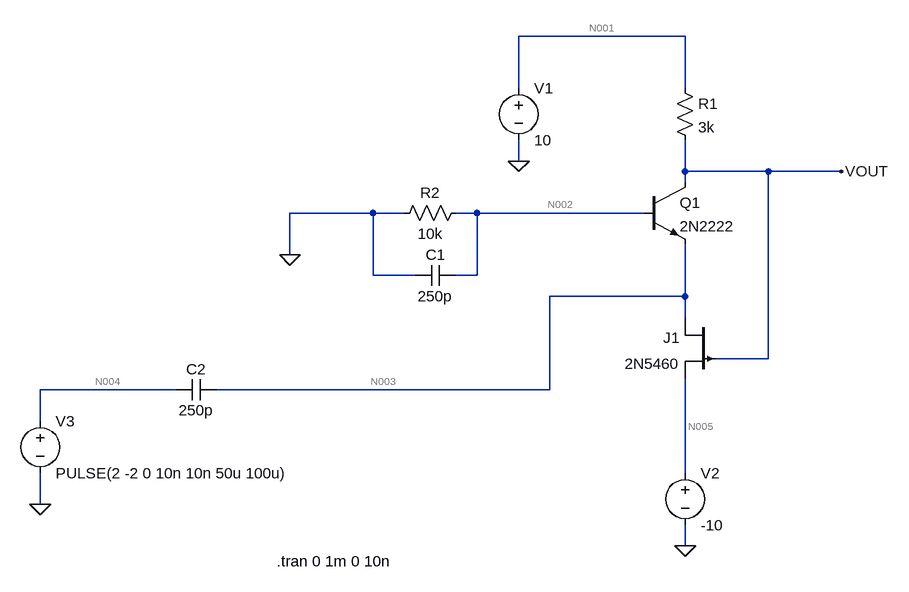
[diagram p0: schematic Bi_stable01.asc]
Bi_stable01.asc, the LTspice schematic file:
Version 4
SHEET 1 880 856
WIRE 336 32 80 32
WIRE 80 112 80 32
WIRE 336 112 336 32
WIRE 80 224 80 192
WIRE 336 240 336 192
WIRE 464 240 336 240
WIRE 576 240 464 240
WIRE 336 256 336 240
WIRE -144 304 -272 304
WIRE -96 304 -144 304
WIRE 16 304 -16 304
WIRE 272 304 16 304
WIRE -272 368 -272 304
WIRE -144 400 -144 304
WIRE -80 400 -144 400
WIRE 16 400 16 304
WIRE 16 400 -16 400
WIRE 336 432 336 352
WIRE 336 432 128 432
WIRE 336 464 336 432
WIRE 464 528 464 240
WIRE 464 528 384 528
WIRE -448 576 -656 576
WIRE 128 576 128 432
WIRE 128 576 -384 576
WIRE -656 624 -656 576
WIRE 336 704 336 560
WIRE -656 752 -656 704
WIRE 336 816 336 784
FLAG 80 224 0
FLAG 576 240 VOUT
FLAG 336 816 0
FLAG -656 752 0
FLAG -272 368 0
SYMBOL voltage 80 96 R0
WINDOW 123 0 0 Left 0
WINDOW 39 0 0 Left 0
SYMATTR InstName V1
SYMATTR Value 10
SYMBOL npn 272 256 R0
SYMATTR InstName Q1
SYMATTR Value 2N2222
SYMBOL res 320 96 R0
SYMATTR InstName R1
SYMATTR Value 3k
SYMBOL pjf 384 464 M0
SYMATTR InstName J1
SYMATTR Value 2N5460
SYMBOL voltage 336 688 R0
WINDOW 123 0 0 Left 0
WINDOW 39 0 0 Left 0
SYMATTR InstName V2
SYMATTR Value -10
SYMBOL voltage -656 608 R0
WINDOW 123 0 0 Left 0
WINDOW 39 0 0 Left 0
SYMATTR InstName V3
SYMATTR Value PULSE(2 -2 0 10n 10n 50u 100u)
SYMBOL res 0 288 R90
WINDOW 0 0 56 VBottom 2
WINDOW 3 32 56 VTop 2
SYMATTR InstName R2
SYMATTR Value 10k
SYMBOL cap -16 384 R90
WINDOW 0 0 32 VBottom 2
WINDOW 3 32 32 VTop 2
SYMATTR InstName C1
SYMATTR Value 250p
SYMBOL cap -384 560 R90
WINDOW 0 0 32 VBottom 2
WINDOW 3 32 32 VTop 2
SYMATTR InstName C2
SYMATTR Value 250p
TEXT -292 840 Left 2 !.tran 0 1m 0 10n

The netlist it stands for:
* Bi_stable01.asc
V1 N001 0 10
Q1 VOUT N002 N003 0 2N2222
R1 N001 VOUT 3k
J1 N003 VOUT N005 2N5460
V2 N005 0 -10
V3 N004 0 PULSE(2 -2 0 10n 10n 50u 100u)
R2 N002 0 10k
C1 N002 0 250p
C2 N003 N004 250p
.model NPN NPN
.model PNP PNP
.lib standard.bjt
.model NJF NJF
.model PJF PJF
.lib standard.jft
.tran 0 1m 0 10n
.backanno
.end

* Results of the author's LTspice run, read from the files saved beside the schematic
* Operating Point, zero values left out:
*   V(n001) = 10 V
*   V(vout) = -8.519 V
*   V(n002) = -7.838 V
*   V(n003) = -8.56 V
*   V(n005) = -10 V
*   V(n004) = 2 V
*   Ic(Q1) = 6.173 mA
*   Ib(Q1) = 783.8 µA
*   Ie(Q1) = -6.957 mA
*   Id(J1) = 6.957 mA
*   Ig(J1) = 4.5 pA
*   Is(J1) = -6.957 mA
*   I(R2) = -783.8 µA
*   I(R1) = 6.173 mA
*   I(V2) = 6.957 mA
*   I(V1) = -6.173 mA
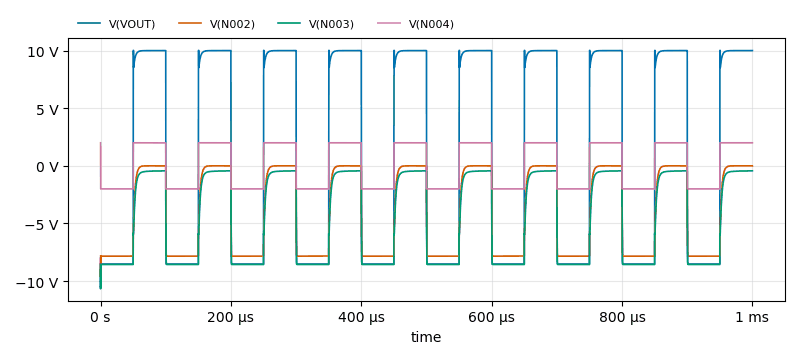
[diagram p1: Transient Analysis of Bi_stable01.asc, plotted from the saved traces]
* Transient Analysis, 1 run:
*   V(VOUT): min -10.59 V, max 10.02 V, average 707 mV, rms 9.234 V, last 9.999 V
*   V(N002): min -9.618 V, max 747.6 µV, average -4.074 V, rms 5.578 V, last 255.8 µV
*   V(N003): min -10.67 V, max -432.9 mV, average -4.677 V, rms 6.108 V, last -432.9 mV
*   V(N004): min -2 V, max 2 V, average -400 µV, rms 2 V, last 2 V